# EAGLE schematic Inverter_v1p0 (EAGLE 9.6.2)
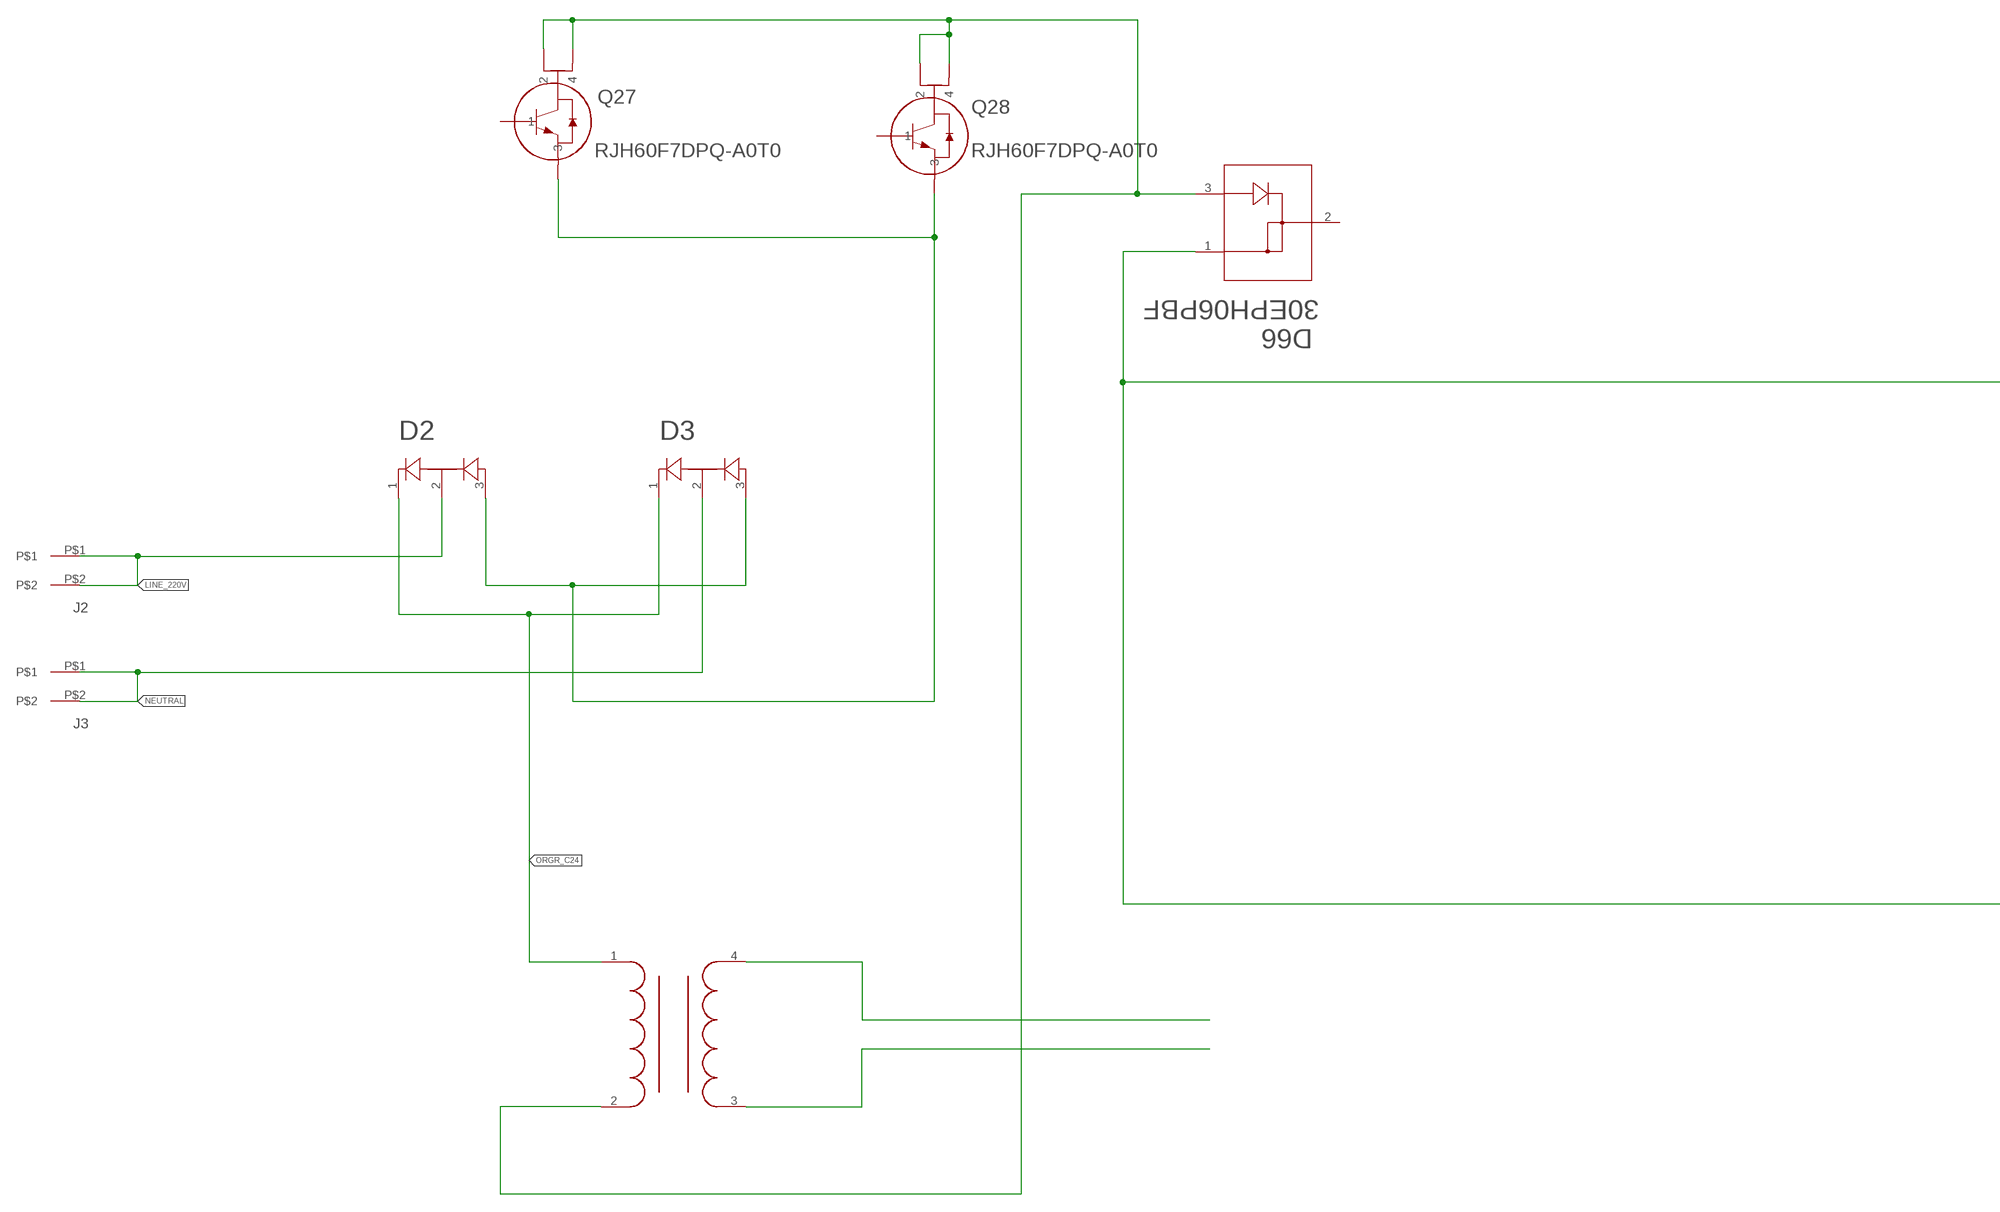
[diagram p0: schematic, sheet 1, part 1 of 2]
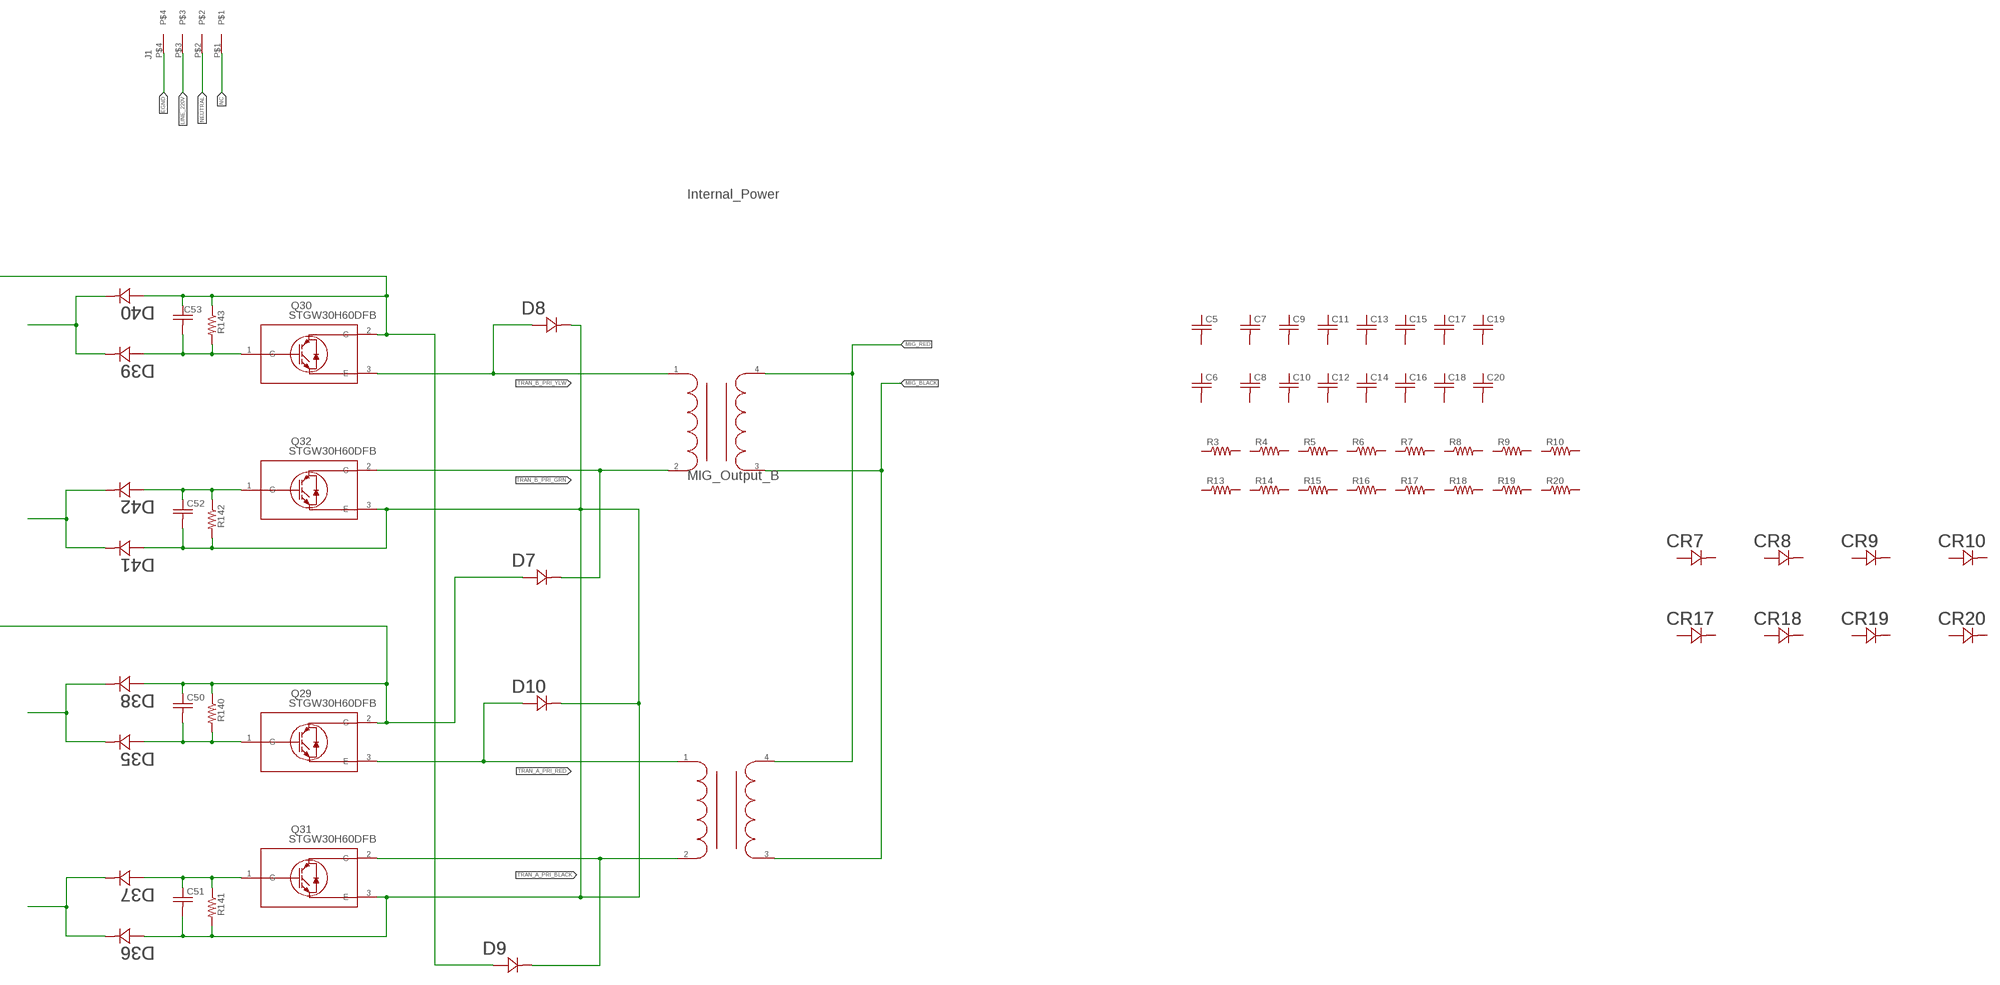
[diagram p1: schematic, sheet 1, part 2 of 2]

## Parts
C5  C_0805  [0805]
C6  C_0805  [0805]
C7  C_0805  [0805]
C8  C_0805  [0805]
C9  C_0805  [0805]
C10  C_0805  [0805]
C11  C_0805  [0805]
C12  C_0805  [0805]
C13  C_0805  [0805]
C14  C_0805  [0805]
C15  C_0805  [0805]
C16  C_0805  [0805]
C17  C_0805  [0805]
C18  C_0805  [0805]
C19  C_0805  [0805]
C20  C_0805  [0805]
C50  C_0805  [0805]
C51  C_0805  [0805]
C52  C_0805  [0805]
C53  C_0805  [0805]
CR7  GF1D-E3  [DO-214BA_VIS]
CR8  GF1D-E3  [DO-214BA_VIS]
CR9  GF1D-E3  [DO-214BA_VIS]
CR10  GF1D-E3  [DO-214BA_VIS]
CR17  GF1D-E3  [DO-214BA_VIS]
CR18  GF1D-E3  [DO-214BA_VIS]
CR19  GF1D-E3  [DO-214BA_VIS]
CR20  GF1D-E3  [DO-214BA_VIS]
D2  SDD25N12  [TO-247AD]
D3  SDD25N12  [TO-247AD]
D7  GF1D-E3  [DO-214BA_VIS]
D8  GF1D-E3  [DO-214BA_VIS]
D9  GF1D-E3  [DO-214BA_VIS]
D10  GF1D-E3  [DO-214BA_VIS]
D35  GF1D-E3  [DO-214BA_VIS]
D36  GF1D-E3  [DO-214BA_VIS]
D37  GF1D-E3  [DO-214BA_VIS]
D38  GF1D-E3  [DO-214BA_VIS]
D39  GF1D-E3  [DO-214BA_VIS]
D40  GF1D-E3  [DO-214BA_VIS]
D41  GF1D-E3  [DO-214BA_VIS]
D42  GF1D-E3  [DO-214BA_VIS]
D66  30EPH06PBF  [TO-247AC_MOD_VIS]
J1  4-pos  3.81MM_1_X_4_RT_ANGLE_PLUG_HEADER  [1X4_3.81MM_PITCH]
J2  2-pos  3.81MM_1_X_2_RT_ANGLE_PLUG_HEADER  [2_3.81MM_PITCH]
J3  2-pos  3.81MM_1_X_2_RT_ANGLE_PLUG_HEADER  [2_3.81MM_PITCH]
Q27  RJH60F7DPQ-A0T0  [TO-247A_REN]
Q28  RJH60F7DPQ-A0T0  [TO-247A_REN]
Q29  STGW30H60DFB  [TO-247_STM]
Q30  STGW30H60DFB  [TO-247_STM]
Q31  STGW30H60DFB  [TO-247_STM]
Q32  STGW30H60DFB  [TO-247_STM]
R3  R_0805  [0805]
R4  R_0805  [0805]
R5  R_0805  [0805]
R6  R_0805  [0805]
R7  R_0805  [0805]
R8  R_0805  [0805]
R9  R_0805  [0805]
R10  R_0805  [0805]
R13  R_0805  [0805]
R14  R_0805  [0805]
R15  R_0805  [0805]
R16  R_0805  [0805]
R17  R_0805  [0805]
R18  R_0805  [0805]
R19  R_0805  [0805]
R20  R_0805  [0805]
R140  R_0805  [0805]
R141  R_0805  [0805]
R142  R_0805  [0805]
R143  R_0805  [0805]
U$1  GENERIC_TRANSFORMER  [GENERIC_TRANSFORMER]
U$2  GENERIC_TRANSFORMER  [GENERIC_TRANSFORMER]
U$3  GENERIC_TRANSFORMER  [GENERIC_TRANSFORMER]

## Nets
EGND: J1.P$4
LINE_220V: D2.2 J1.P$3 J2.P$1 J2.P$2
MIG_BLACK: U$1.3 U$2.3
MIG_RED: U$1.4 U$2.4
N$1: C51.1 D37.2 Q31.1(G) R141.1
N$2: D66.3 Q27.2 Q27.4 Q28.2 Q28.4 U$3.2
N$3: D36.1 D37.1
N$4: C50.2 D35.2 Q29.1(G) R140.2
N$5: U$3.4
N$6: C53.2 D39.2 Q30.1(G) R143.2
N$7: C50.1 C53.1 D7.2 D9.2 D38.2 D40.2 D66.1 Q29.2(C) Q30.2(C) R140.1 R143.1
N$8: C52.1 D42.2 Q32.1(G) R142.1
N$9: C51.2 C52.2 D8.1 D10.1 D36.2 D41.2 Q31.3(E) Q32.3(E) R141.2 R142.2
N$10: D41.1 D42.1
N$11: D35.1 D38.1
N$12: D39.1 D40.1
N$13: D2.3 D3.3 Q27.3 Q28.3
N$14: U$3.3
NC: J1.P$1
NEUTRAL: D3.2 J1.P$2 J3.P$1 J3.P$2
ORGR_C24: D2.1 D3.1 U$3.1
TRAN_A_PRI_BLACK: D9.1 Q31.2(C) U$2.2
TRAN_A_PRI_RED: D10.2 Q29.3(E) U$2.1
TRAN_B_PRI_GRN: D7.1 Q32.2(C) U$1.2
TRAN_B_PRI_YLW: D8.2 Q30.3(E) U$1.1
Unconnected: C5.1 C5.2 C6.1 C6.2 C7.1 C7.2 C8.1 C8.2 C9.1 C9.2 C10.1 C10.2 C11.1 C11.2 C12.1 C12.2 C13.1 C13.2 C14.1 C14.2 C15.1 C15.2 C16.1 C16.2 C17.1 C17.2 C18.1 C18.2 C19.1 C19.2 C20.1 C20.2 CR7.1 CR7.2 CR8.1 CR8.2 CR9.1 CR9.2 CR10.1 CR10.2 CR17.1 CR17.2 CR18.1 CR18.2 CR19.1 CR19.2 CR20.1 CR20.2 D66.2 Q27.1 Q28.1 R3.1 R3.2 R4.1 R4.2 R5.1 R5.2 R6.1 R6.2 R7.1 R7.2 R8.1 R8.2 R9.1 R9.2 R10.1 R10.2 R13.1 R13.2 R14.1 R14.2 R15.1 R15.2 R16.1 R16.2 R17.1 R17.2 R18.1 R18.2 R19.1 R19.2 R20.1 R20.2

## Notes on the sheet
- Internal_Power
- MIG_Output_B

## Library data of the parts
C5-C20 C50-C53 = 3D_MIG_Controller:C_0805
CR7-CR10 CR17-CR20 D7-D10 D35-D42 = 3D_MIG_Controller:GF1D-E3; BUILT_BY: EMA_UL_Team; MANUFACTURER_PART_NUMBER: GF1D-E3; SOURCELIBRARY: Vishay_2020-02-10; VENDOR: Vishay
D2 D3 = 3D_MIG_Controller:SDD25N12
D66 = 3D_MIG_Controller:30EPH06PBF; BUILT_BY: EMA_UL_Team; MANUFACTURER_PART_NUMBER: 30EPH06PBF; SOURCELIBRARY: Vishay_2020-02-10; VENDOR: Vishay
J1 = 3D_MIG_Controller:3.81MM_1_X_4_RT_ANGLE_PLUG_HEADER: 4 Position Terminal Block Header, Male Pins, Shrouded (4 Side) 0.150" (3.81mm) 90°, Right Angle - Through Hole; PARTNO: 691322310004
J2 J3 = 3D_MIG_Controller:3.81MM_1_X_2_RT_ANGLE_PLUG_HEADER: TERM BLOCK HDR 2POS 90DEG 3.81MM; PARTNO: 691322310002
Q27 Q28 = 3D_MIG_Controller:RJH60F7DPQ-A0T0; BUILT_BY: EMA_UL_Team; MANUFACTURER_PART_NUMBER: RJH60F7DPQ-A0#T0; SOURCELIBRARY: Renesas_2011-03-28_IGBT; VENDOR: Renesas Electronics
Q29-Q32 = 3D_MIG_Controller:STGW30H60DFB; BUILT_BY: EMA_Cory; COPYRIGHT: Copyright (C) 2018 Accelerated Designs. All rights reserved; DATASHEET: https://www.st.com/resource/en/datasheet/stgw30h60dfb.pdf; MANUFACTURER_PART_NUMBER: STGW30H60DFB; SOURCELIBRARY: Update_to_database_2020-11-23; VENDOR: STMicroelectronics
R3-R10 R13-R20 R140-R143 = 3D_MIG_Controller:R_0805
U$1-U$3 = 3D_MIG_Controller:GENERIC_TRANSFORMER